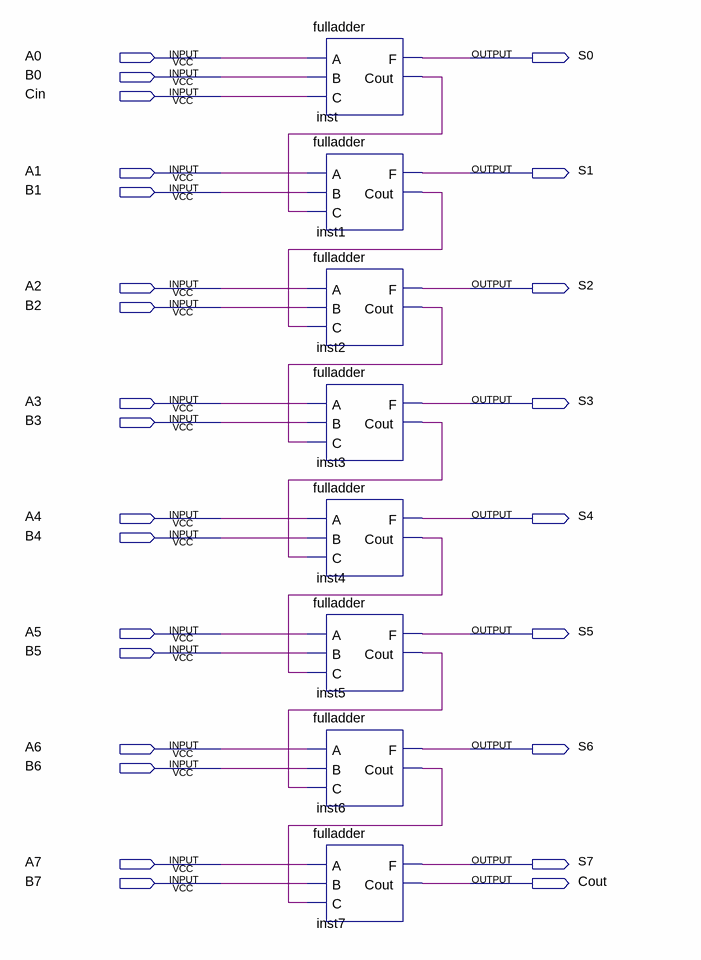
[diagram p0: schematic sheet]
// Quartus schematic sum8.bdf as structural Verilog: 8 symbols, 26 pins
module sum8 (
  input  A0,
  input  B0,
  input  Cin,
  input  A1,
  input  B1,
  input  A2,
  input  B2,
  input  A3,
  input  B3,
  input  A4,
  input  B4,
  input  A5,
  input  B5,
  input  A6,
  input  B6,
  input  A7,
  input  B7,
  output S0,
  output S1,
  output S2,
  output S3,
  output S4,
  output S5,
  output S6,
  output S7,
  output Cout
);

  wire inst1_cout, inst2_cout, inst3_cout, inst4_cout, inst5_cout, inst6_cout, inst_cout;

  fulladder inst (.A(A0), .B(B0), .C(Cin), .F(S0), .Cout(inst_cout));
  fulladder inst1 (.A(A1), .B(B1), .C(inst_cout), .F(S1), .Cout(inst1_cout));
  fulladder inst2 (.A(A2), .B(B2), .C(inst1_cout), .F(S2), .Cout(inst2_cout));
  fulladder inst3 (.A(A3), .B(B3), .C(inst2_cout), .F(S3), .Cout(inst3_cout));
  fulladder inst4 (.A(A4), .B(B4), .C(inst3_cout), .F(S4), .Cout(inst4_cout));
  fulladder inst5 (.A(A5), .B(B5), .C(inst4_cout), .F(S5), .Cout(inst5_cout));
  fulladder inst6 (.A(A6), .B(B6), .C(inst5_cout), .F(S6), .Cout(inst6_cout));
  fulladder inst7 (.A(A7), .B(B7), .C(inst6_cout), .F(S7), .Cout(Cout));
endmodule
